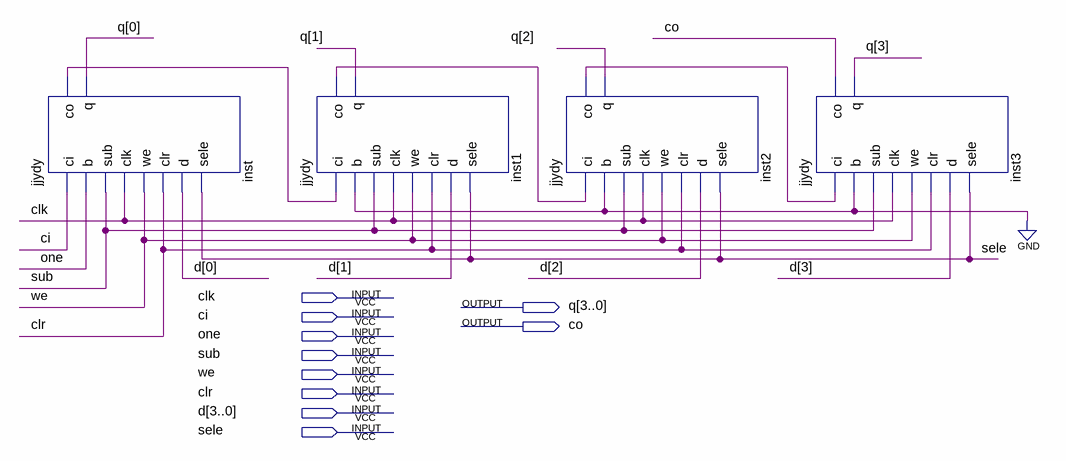
[diagram p0: schematic sheet]
// Quartus schematic jcqdy_4.bdf as structural Verilog: 4 symbols, 10 pins
module jcqdy_4 (
  input  clk,
  input  ci,
  input  one,
  input  sub,
  input  we,
  input  clr,
  input  [3:0] d,
  input  sele,
  output [3:0] q,
  output co
);

  wire inst1_co, inst2_co, inst_co;

  jjydy inst (
    .ci(ci), .b(one), .sub(sub), .clk(clk), .we(we), .clr(clr), .d(d[0]), .sele(sele), .co(inst_co), .q(q[0]));
  jjydy inst1 (
    .ci(inst_co), .b(1'b0), .sub(sub), .clk(clk), .we(we), .clr(clr), .d(d[1]), .sele(sele), .co(inst1_co),
    .q(q[1]));
  jjydy inst2 (
    .ci(inst1_co), .b(1'b0), .sub(sub), .clk(clk), .we(we), .clr(clr), .d(d[2]), .sele(sele), .co(inst2_co),
    .q(q[2]));
  jjydy inst3 (
    .ci(inst2_co), .b(1'b0), .sub(sub), .clk(clk), .we(we), .clr(clr), .d(d[3]), .sele(sele), .co(co),
    .q(q[3]));
endmodule
